# Altium schematic sheet blank_template.SchDoc: Fault-Tolerant Quadcopter
size A; DrawnBy: Vaughn Kottler; Engineer: Vaughn Kottler; Revision: A
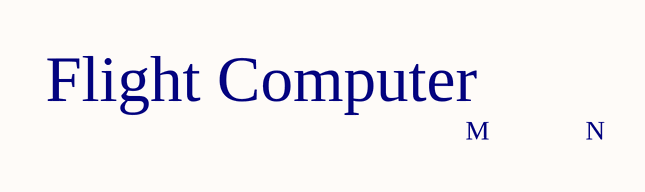
[diagram p0: blank_template.SchDoc]

## Notes on the sheet
- Flight Computer
- M
- N